# EAGLE design AccessControl (EAGLE 6.3)
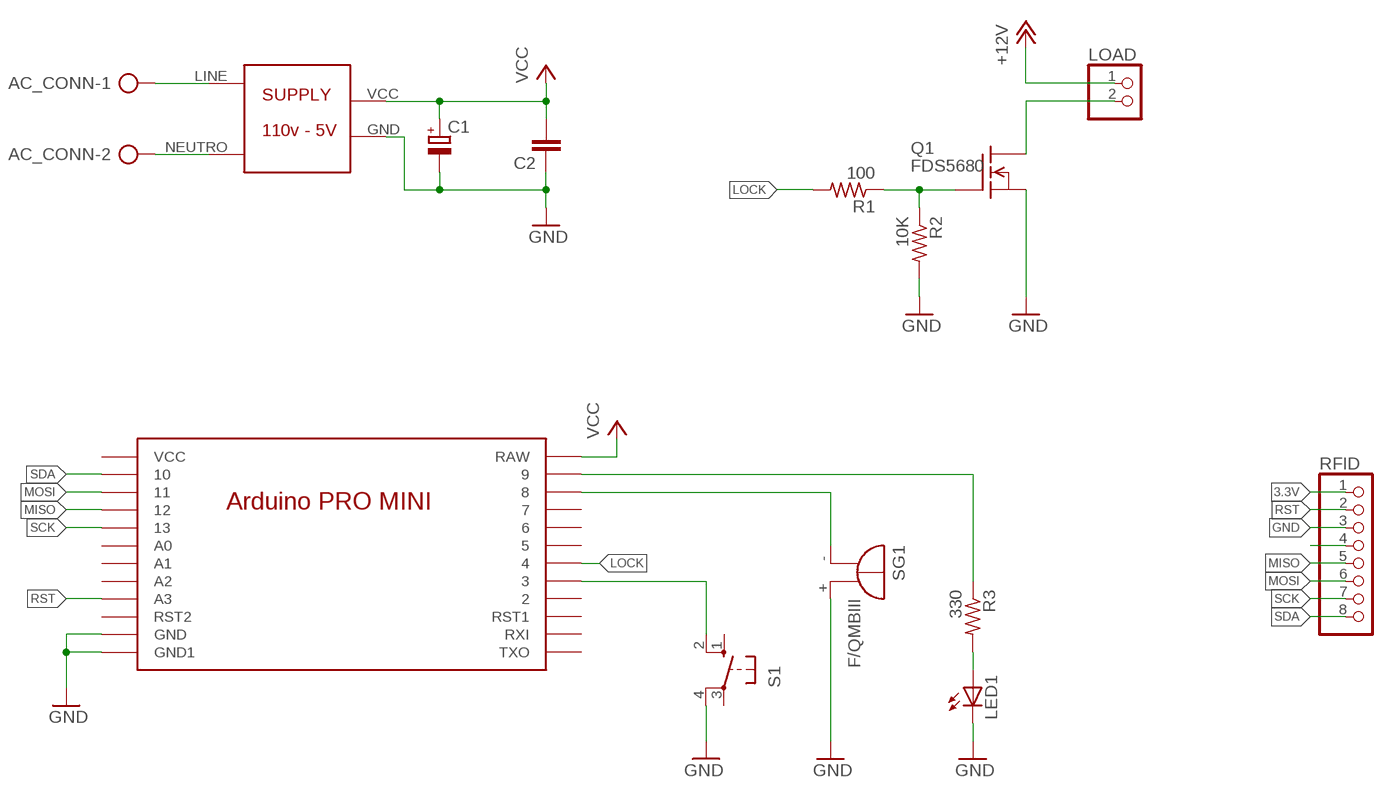
[diagram p0: schematic, sheet 1]

## Parts
AC_CONN  AK300/2  [AK300/2]
C1  CPOL-EUE2.5-6  [E2,5-6]
C2  C2.5/2  [C2.5-2]
LED1  LED3MM  [LED3MM]
LOAD  PINHD-1X2  [1X02]
Q1  FDS5680  [SO-8]
R1  100  R-US_0204/7  [0204/7]
R2  10K  R-US_0204/7  [0204/7]
R3  330  R-US_0204/7  [0204/7]
RFID  PINHD-1X8  [1X08]
S1  10-XX  [B3F-10XX]
SG1  F/QMBIII  [F/QMBIII]
U$1  NANO  [NANO]
U$2  SUPPLY5V  [SUPPLY5V]

## Nets
3.3V: RFID.1
+12V: LOAD.1
GND: C1.- C2.1 LED1.K(C) Q1.1(S) Q1.2(S) Q1.3(S) R2.2 RFID.3 S1.4(P1) SG1.+(-) U$1.GND1(GND) U$1.GND2(GND1) U$2.GND
LOCK: R1.2 U$1.4
MISO: RFID.5 U$1.12
MOSI: RFID.6 U$1.11
N$1: Q1.4(G) R1.1 R2.1
N$2: AC_CONN.2 U$2.NEUTRO
N$3: LOAD.2 Q1.5(D) Q1.6(D) Q1.7(D) Q1.8(D)
N$4: LED1.A R3.2
N$5: AC_CONN.1 U$2.LINE
N$6: SG1.-(+) U$1.8
N$7: S1.2(S1) U$1.3
N$8: R3.1 U$1.9
NC: RFID.4
RST: RFID.2 U$1.A3
SCK: RFID.7 U$1.13
SDA: RFID.8 U$1.10
VCC: C1.+ C2.2 U$1.RAW U$2.VCC
Unconnected: S1.1(S) S1.3(P) U$1.2 U$1.5 U$1.6 U$1.7 U$1.A0 U$1.A1 U$1.A2 U$1.RST1 U$1.RST2 U$1.RXI U$1.TXO U$1.VCC

## Library data of the parts
AC_CONN = con-ptr500:AK300/2: CONNECTOR; OC_FARNELL: unknown; OC_NEWARK: unknown
C1 = resistor:CPOL-EU: POLARIZED CAPACITOR, European symbol
C2 = capacitor-wima:C: CAPACITOR naming: grid - package width
LED1 = led:LED: LED OSRAM: - CHIPLED LG R971, LG N971, LY N971, LG Q971, LY Q971, LO R971, LY R971 LH N974, LH R974 LS Q976, LO Q976, LY Q976 LO Q996 - Hyper CHIPLED LW Q18S LB Q993, LB Q99A, LB R99A - SideLED LS A670, LO A670, LY A670, LG A670, LP A670 LB A673, LV A673, LT A673, LW A673 LH A674 LY A675 LS A676, LA A676, LO A676, LY A676, LW A676 LS A679, LY A679, LG A679 - Hyper Micro SIDELED® LS Y876, LA Y876, LO Y876, LY Y876 LT Y87S - SmartLED LW L88C, LW L88S LB L89C, LB L89S, LG L890 LS L89K, LO L89K, LY L89K LS L896, LA L896, LO L896, LY L896 - TOPLED LS T670, LO T670, LY T670, LG T670, LP T670 LSG T670, LSP T670, LSY T670, LOP T670, LYG T670 LG T671, LOG T671, LSG T671 LB T673, LV T673, LT T673, LW T673 LH T674 LS T676, LA T676, LO T676, LY T676, LB T676, LH T676, LSB T676, LW T676 LB T67C, LV T67C, LT T67C, LS T67K, LO T67K, LY T67K, LW E67C LS E67B, LA E67B, LO E67B, LY E67B, LB E67C, LV E67C, LT E67C LW T67C LS T679, LY T679, LG T679 LS T770, LO T770, LY T770, LG T770, LP T770 LB T773, LV T773, LT T773, LW T773 LH T774 LS E675, LA E675, LY E675, LS T675 LS T776, LA T776, LO T776, LY T776, LB T776 LHGB T686 LT T68C, LB T68C - Hyper Mini TOPLED® LB M676 - Mini TOPLED Santana® LG M470 LS M47K, LO M47K, LY M47K Source: http://www.osram.convergy.de LUXEON: - LUMILED® LXK2-PW12-R00, LXK2-PW12-S00, LXK2-PW14-U00, LXK2-PW14-V00 LXK2-PM12-R00, LXK2-PM12-S00, LXK2-PM14-U00 LXK2-PE12-Q00, LXK2-PE12-R00, LXK2-PE12-S00, LXK2-PE14-T00, LXK2-PE14-U00 LXK2-PB12-K00, LXK2-PB12-L00, LXK2-PB12-M00, LXK2-PB14-N00, LXK2-PB14-P00, LXK2-PB14-Q00 LXK2-PR12-L00, LXK2-PR12-M00, LXK2-PR14-Q00, LXK2-PR14-R00 LXK2-PD12-Q00, LXK2-PD12-R00, LXK2-PD12-S00 LXK2-PH12-R00, LXK2-PH12-S00 LXK2-PL12-P00, LXK2-PL12-Q00, LXK2-PL12-R00 Source: www.luxeon.com KINGBRIGHT: KA-3528ASYC Source: www.kingbright.com
LOAD = pinhead:PINHD-1X2: PIN HEADER
Q1 = transistor-fet:FDS5680: 60V N-Channel PowerTrench TM MOSFET FAIRCHILD FDS5680.pdf
R1-R3 = resistor:R-US_: RESISTOR, American symbol
RFID = pinhead:PINHD-1X8: PIN HEADER
S1 = switch-omron:10-XX: OMRON SWITCH; MPN: B3F-1000; OC_FARNELL: 176432; OC_NEWARK: 36M3542
SG1 = buzzer:F/QMBIII: BUZZER Source: Buerklin; OC_FARNELL: unknown; OC_NEWARK: unknown
U$1 = E-Lab:NANO
U$2 = E-Lab:SUPPLY5V

## Board
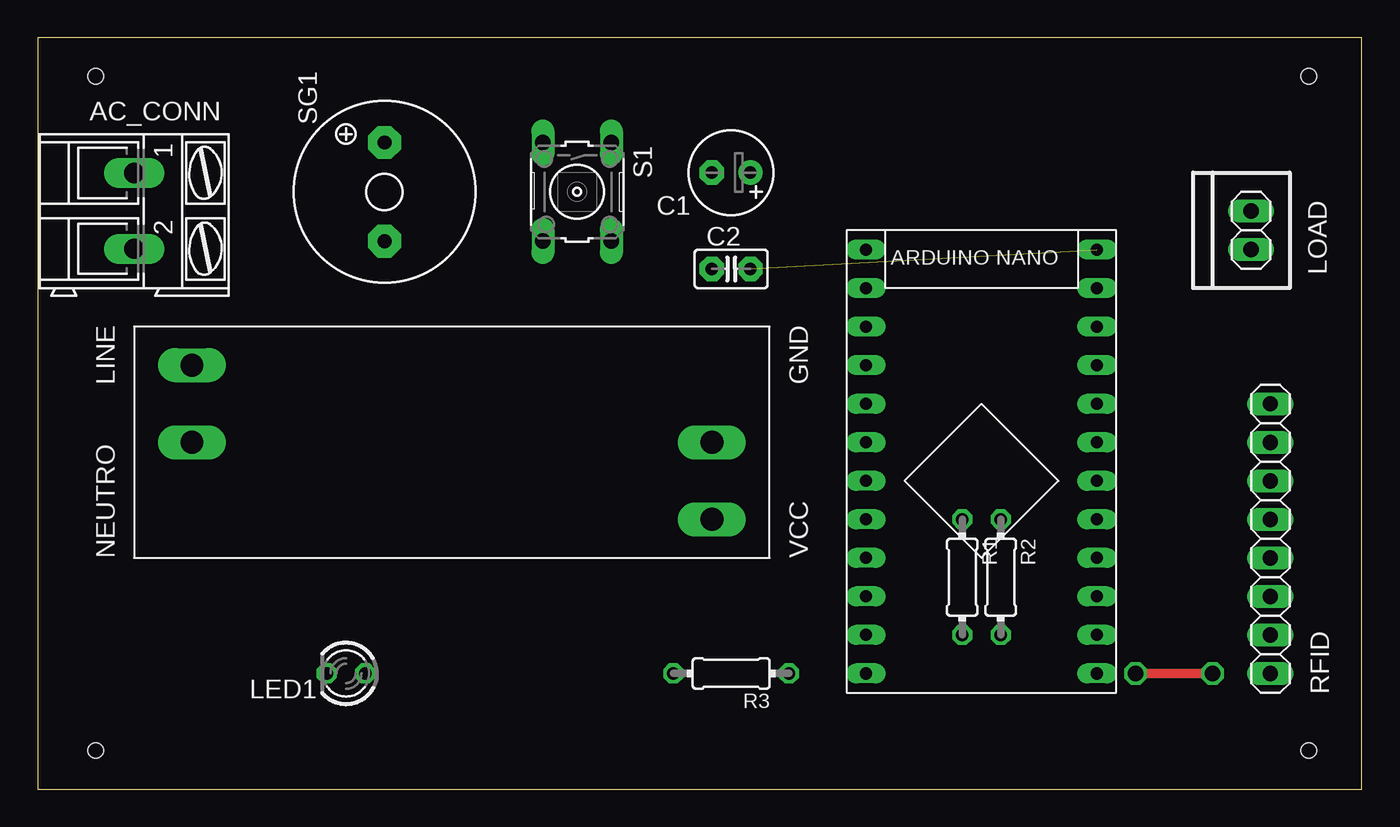
[diagram p1: board, top side]
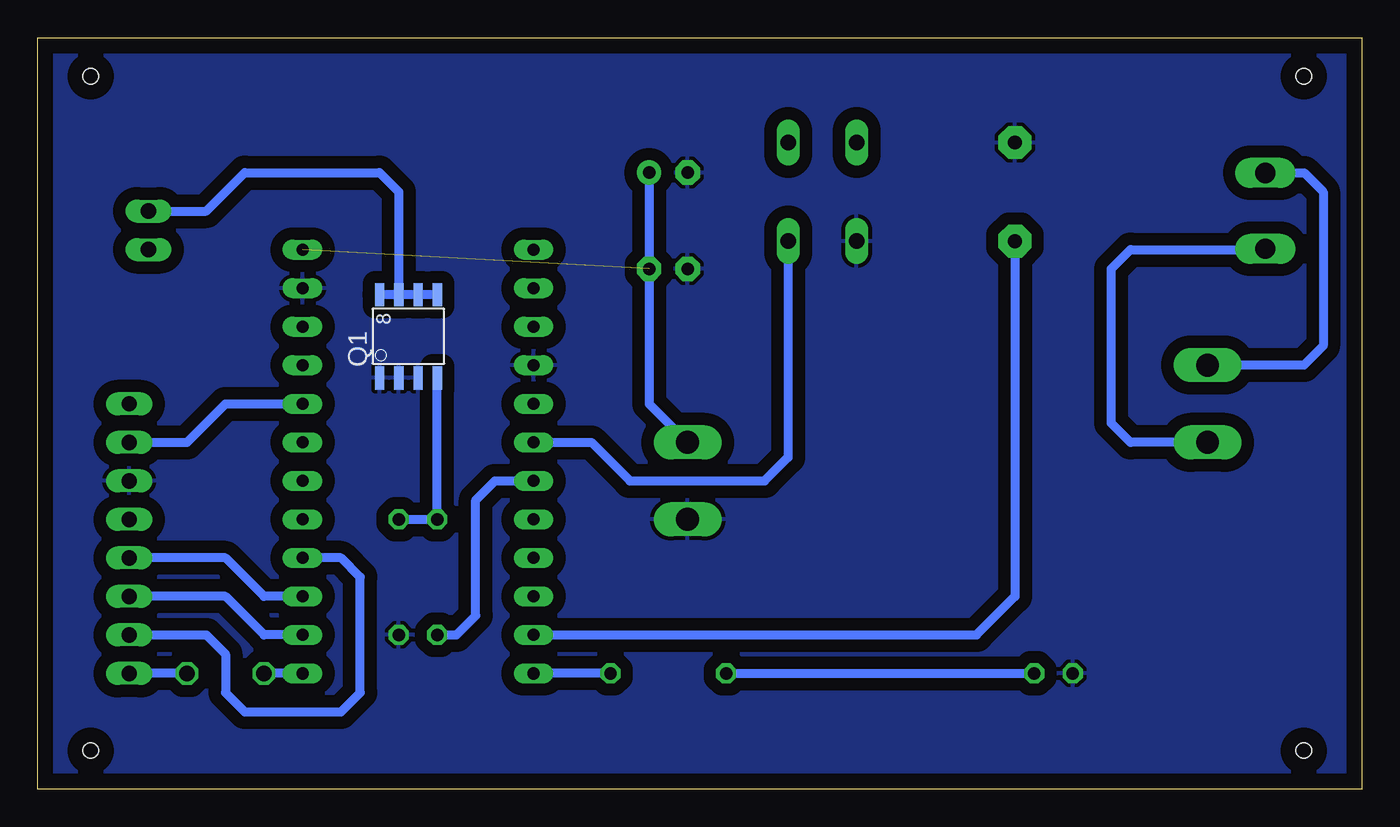
[diagram p2: board, bottom side, seen from below]

Size 87.3 x 49.52 mm. Coordinates in mm from the lower left corner, seen from the top.
Outline: 0,0 87.3,0 87.3,49.52 0,49.52 0,0
Copper layers (1*16): Top 0.035mm / dielectric 1.5mm / Bottom 0.035mm
Design rules "default": minimum track width 10mil, minimum drill 24mil, track to track 8mil, track to pad 8mil, pad to pad 8mil, via to via 8mil, smd to smd 8mil, copper to edge 40mil, drill to drill 8mil, minimum pad ring 10mil, minimum via ring 8mil, stop-mask expansion 4mil, vias tented up to drill 0mil, thermal gap 10mil
Holes 1 mm at 3.81,2.54 3.81,46.99 83.82,46.99 83.82,2.54

### Footprints (pad centres in the part's own frame; a part is rotated, then mirrored left to right if it is on the bottom)
AK300/2 = drill 1.321 long: 1 -2.515,0; 2 2.489,0
E2,5-6 = drill 0.813 pad 1.6: + -1.27,0 | drill 0.813 pad 1.6 octagon: - 1.27,0
C2.5-2 = drill 0.813 pad 1.6 octagon: 1 -1.27,0; 2 1.27,0
LED3MM = drill 0.813 octagon: A -1.27,0; K 1.27,0
1X02 = drill 1.016 long: 1 -1.27,0; 2 1.27,0
SO-8 = smd 1.524 x 0.61: 1 -2.743,1.905; 2 -2.743,0.635; 3 -2.743,-0.635; 4 -2.743,-1.905; 5 2.743,-1.905; 6 2.743,-0.635; 7 2.743,0.635; 8 2.743,1.905
0204/7 = drill 0.813 octagon: 1 -3.81,0; 2 3.81,0
1X08 = drill 1.016 long: 1 -8.89,0; 2 -6.35,0; 3 -3.81,0; 4 -1.27,0; 5 1.27,0; 6 3.81,0; 7 6.35,0; 8 8.89,0
B3F-10XX = drill 1.016 long: 1 -3.251,2.261; 2 3.251,2.261; 3 -3.251,-2.261; 4 3.251,-2.261
F/QMBIII = drill 0.914 pad 2.159 octagon: + 3.251,0; - -3.251,0
NANO = drill 0.8 long: 2 7.62,-5.08; 3 7.62,-2.54; 4 7.62,0; 5 7.62,2.54; 6 7.62,5.08; 7 7.62,7.62; 8 7.62,10.16; 9 7.62,12.7; 10 -7.62,12.7; 11 -7.62,10.16; 12 -7.62,7.62; 13 -7.62,5.08; A0 -7.62,2.54; A1 -7.62,0; A2 -7.62,-2.54; A3 -7.62,-5.08; GND1 -7.62,-12.7; GND2 7.62,-7.62; RAW -7.62,-15.24; RST1 -7.62,-10.16; RST2 7.62,-10.16; RXI 7.62,-12.7; TXO 7.62,-15.24; VCC -7.62,-7.62
SUPPLY5V = drill 1.5 long: GND 17.78,-5.08; LINE -16.51,5.08; NEUTRO -16.51,0; VCC 17.78,0

### Placement (x,y rotation side)
AC_CONN  6.35,38.1 270 top
C1  45.72,40.64 180 top
C2  45.72,34.29 0 top
LED1  20.32,7.62 180 top
LOAD  80.01,36.83 90 top
Q1  62.87,29.84 90 bottom
R1  60.96,13.97 270 top
R2  63.5,13.97 270 top
R3  45.72,7.62 180 top
RFID  81.28,16.51 270 top
S1  35.56,39.37 270 top
SG1  22.86,39.37 90 top
U$1  62.23,20.32 180 top
U$2  26.67,22.86 0 top

### Tracks (layer width: path | path; a pad name or v marks a point on that pad's centre or on a via)
GND
  pour Bottom (isolate 0.813): 0,0 0,49.53 87.63,49.53 87.63,0
LOCK
  Bottom 0.61: R1.2 59.69,10.16 58.42,11.43 58.42,19.05 57.15,20.32 U$1.4
MISO
  Bottom 0.61: U$1.12 72.39,12.7 74.93,15.24 RFID.5
MOSI
  Bottom 0.61: U$1.11 72.39,10.16 74.93,12.7 RFID.6
N$1
  Bottom 0.61: Q1.4 R1.1 R2.1
N$2
  Bottom 0.61: U$2.NEUTRO 15.24,22.86 16.51,24.13 16.51,34.29 15.24,35.56 6.4,35.56 AC_CONN.2
N$3
  Bottom 0.61: Q1.5 Q1.6 Q1.7 | Q1.7 Q1.8 | LOAD.2 76.2,38.1 73.66,40.64 64.77,40.64 63.5,39.37 Q1.7
N$4
  Bottom 0.61: R3.2 LED1.A
N$5
  Bottom 0.61: AC_CONN.1 3.79,40.62 2.54,39.37 2.54,29.21 3.81,27.94 U$2.LINE
N$6
  Bottom 0.61: U$1.8 25.4,10.16 22.86,12.7 SG1.-
N$7
  Bottom 0.61: U$1.3 50.8,22.86 48.26,20.32 39.37,20.32 37.82,21.87 S1.2
N$8
  Bottom 0.61: R3.1 U$1.9
RST
  Bottom 0.61: RFID.2 77.47,22.86 74.93,25.4 U$1.A3
SCK
  Bottom 0.61: RFID.7 76.2,10.16 74.93,8.89 74.93,6.35 73.66,5.08 67.31,5.08 66.04,6.35 66.04,13.97 67.31,15.24 U$1.13
SDA  (via drill 1)
  Top 0.61: v72.39,7.62 v77.47,7.62
  Bottom 0.61: U$1.10 v72.39,7.62 | v77.47,7.62 RFID.8
VCC  (1 unrouted)
  Bottom 0.61: U$2.VCC 46.99,25.4 C2.2 C1.+